# EAGLE schematic Main (EAGLE 7.7.0)
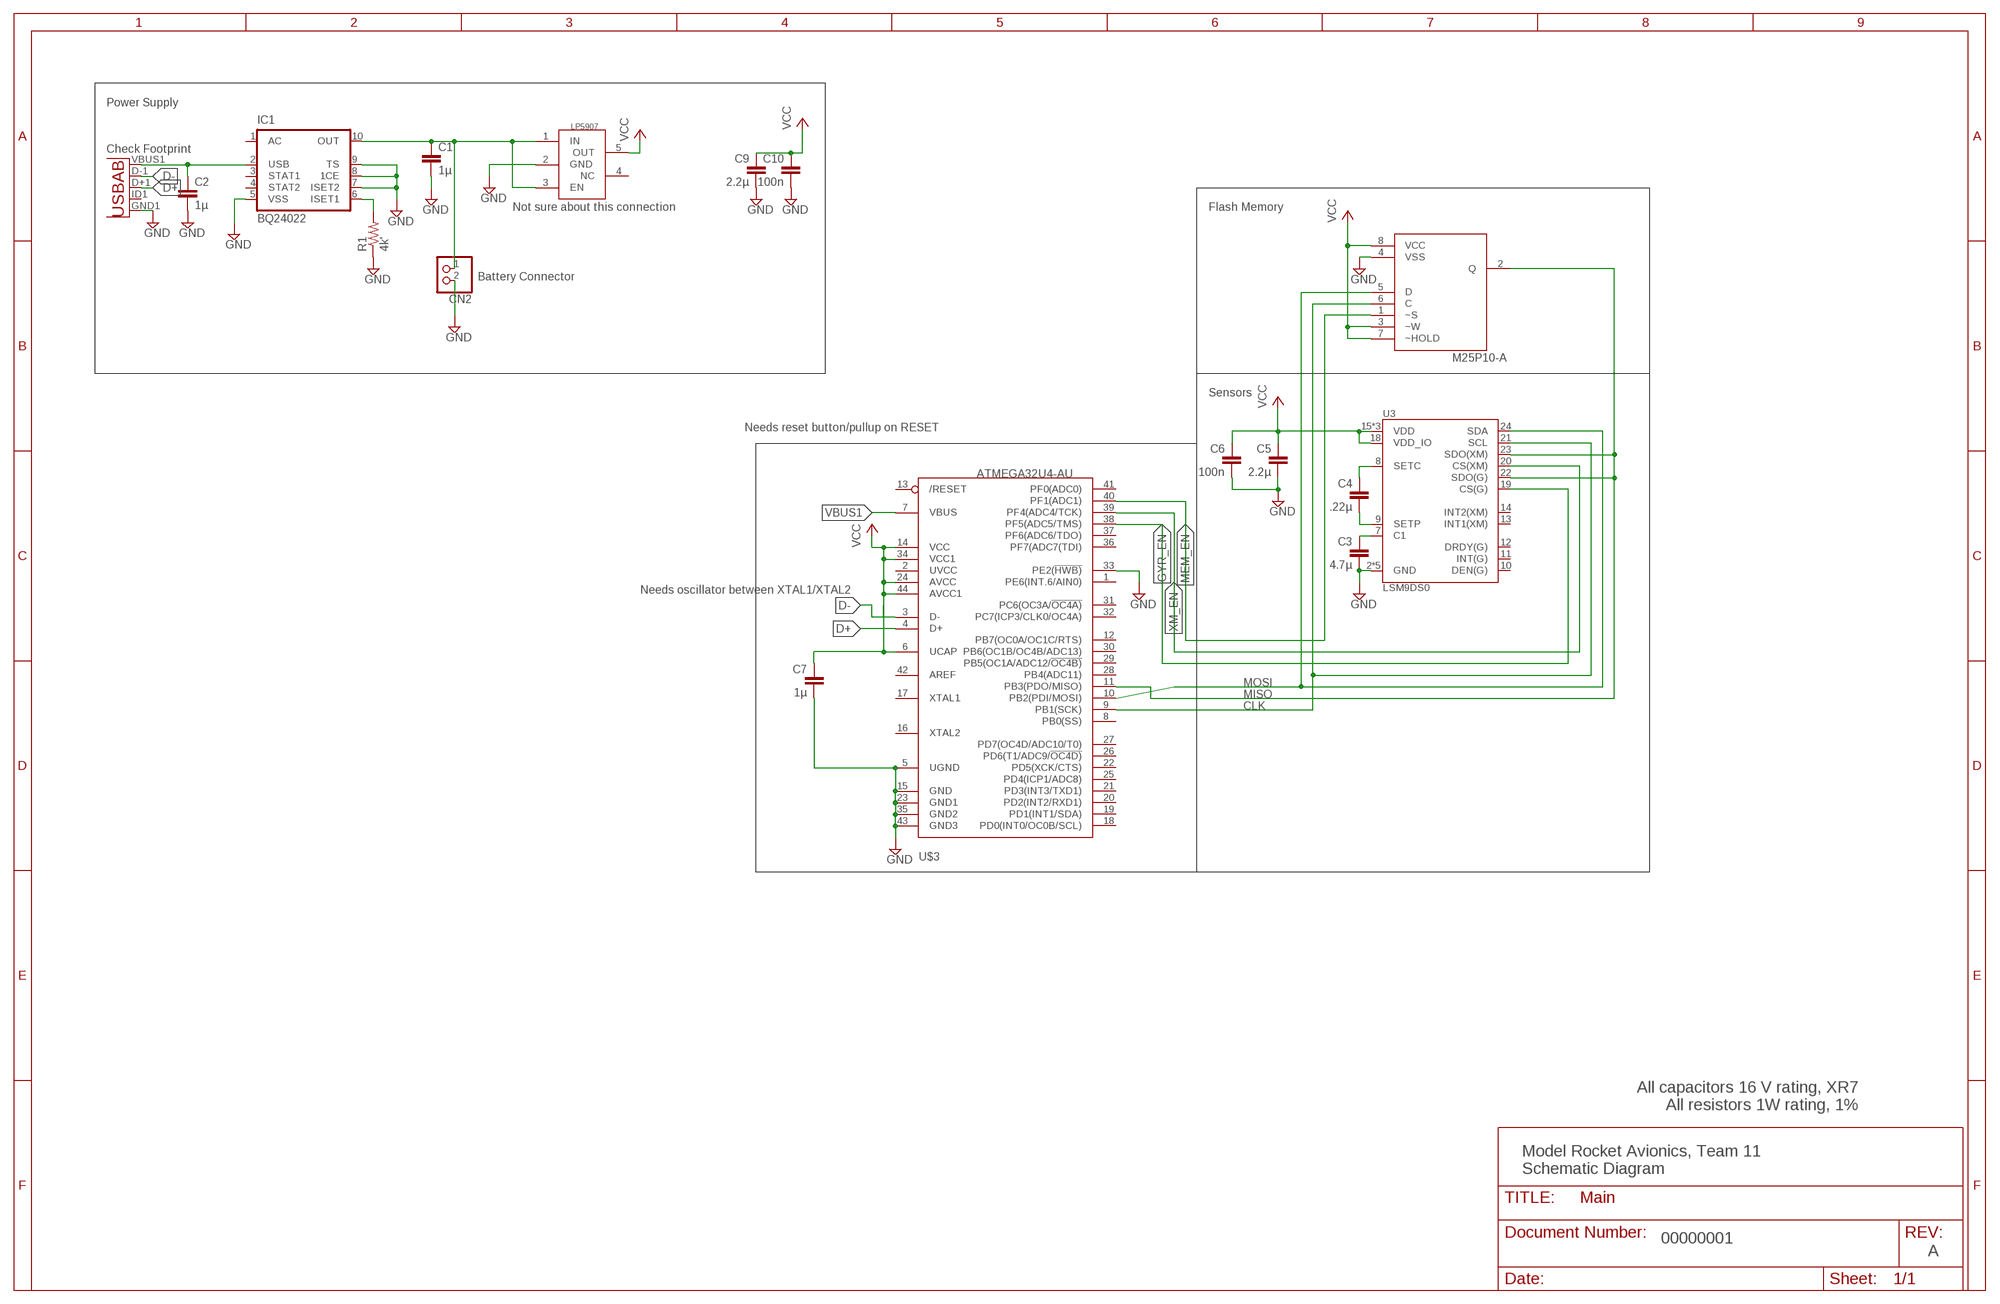
[diagram p0: schematic, sheet 1]

## Parts
C1  1µ  C-EU050-025X075  [C050-025X075]
C2  1µ  C-EU050-025X075  [C050-025X075]
C3  4.7µ  C-EUC0805  [C0805]
C4  .22µ  C-EUC0805  [C0805]
C5  2.2µ  C-EUC0805  [C0805]
C6  100n  C-EUC0805  [C0805]
C7  1µ  C-EUC0805  [C0805]
C9  2.2µ  C-EUC0805  [C0805]
C10  100n  C-EUC0805  [C0805]
CN2  JST_2PIN-SMT-RA  [JST-PH-2-SMT-RA]
IC1  BQ24022  [DRC-S-PVSON-N10]
R1  4k'  R-US_0309/12  [0309/12]
U1  USB_In  USB""  [USB-MICRO-SMD]
U3  LSM9DS0  [LGA-24]
U$1  M25P10-AVMN6TP_TR  [SOIC127P600X175-8N]
U$2  LP5907  [SOT23-5L]
U$3  ATMEGA32U4-AU  [TQFP44]

## Nets
CLK: U3.21(SCL) U$1.6(C) U$3.9(PB1(SCK))
D+: U1.D+1(D+) U$3.4(D+)
D-: U1.D-1(D-) U$3.3(D-)
GND: C1.2 C2.2 C3.1 C5.2 C6.2 C7.2 C9.2 C10.2 CN2.2 IC1.5(VSS) IC1.7(ISET2) IC1.8(1CE) IC1.9(TS) R1.1 U1.GND1(GND) U3.2(GND) U3.3(GND) U3.4(GND) U3.5(GND) U3.6(GND) U$1.4(VSS) U$2.2(GND) U$3.5(UGND) U$3.15(GND) U$3.23(GND1) U$3.33(PE2(!HWB)) U$3.35(GND2) U$3.43(GND3)
GYR_EN: U3.19(CS(G)) U$3.38(PF5(ADC5/TMS))
MEM_EN: U$1.1(~S) U$3.40(PF1(ADC1))
MISO: U3.22(SDO(G)) U3.23(SDO(XM)) U$1.2(Q) U$3.11(PB3(PDO/MISO))
MOSI: U3.24(SDA) U$1.5(D) U$3.10(PB2(PDI/MOSI))
N$1: C2.1 IC1.2(USB) U1.VBUS1(VBUS)
N$4: IC1.6(ISET1) R1.2
N$9: C3.2 U3.7(C1)
N$10: C4.2 U3.8(SETC)
N$11: C4.1 U3.9(SETP)
N$17: C1.1 CN2.1 IC1.10(OUT) U$2.1(IN) U$2.3(EN)
VBUS1: U$3.7(VBUS)
VCC: C5.1 C6.1 C7.1 C9.1 C10.1 U3.15(VDD) U3.16(VDD) U3.17(VDD) U3.18(VDD_IO) U$1.3(~W) U$1.7(~HOLD) U$1.8(VCC) U$2.5(OUT) U$3.6(UCAP) U$3.14(VCC) U$3.24(AVCC) U$3.34(VCC1) U$3.44(AVCC1)
XM_EN: U3.20(CS(XM)) U$3.39(PF4(ADC4/TCK))
Unconnected: IC1.1(AC) IC1.3(STAT1) IC1.4(STAT2) IC1.TH U1.ID1(USBID) U3.10(DEN(G)) U3.11(INT(G)) U3.12(DRDY(G)) U3.13(INT1(XM)) U3.14(INT2(XM)) U$2.4(NC) U$3.1(PE6(INT.6/AIN0)) U$3.2(UVCC) U$3.8(PB0(SS)) U$3.12(PB7(OC0A/OC1C/RTS)) U$3.13(/RESET) U$3.16(XTAL2) U$3.17(XTAL1) U$3.18(PD0(INT0/OC0B/SCL)) U$3.19(PD1(INT1/SDA)) U$3.20(PD2(INT2/RXD1)) U$3.21(PD3(INT3/TXD1)) U$3.22(PD5(XCK/CTS)) U$3.25(PD4(ICP1/ADC8)) U$3.26(PD6(T1/ADC9/!OC4D)) U$3.27(PD7(OC4D/ADC10/T0)) U$3.28(PB4(ADC11)) U$3.29(PB5(OC1A/ADC12/!OC4B)) U$3.30(PB6(OC1B/OC4B/ADC13)) U$3.31(PC6(OC3A/!OC4A)) U$3.32(PC7(ICP3/CLK0/OC4A)) U$3.36(PF7(ADC7(TDI)) U$3.37(PF6(ADC6/TDO)) U$3.41(PF0(ADC0)) U$3.42(AREF)

## Notes on the sheet
- Power Supply
- Check Footprint
- Not sure about this connection | Flash Memory
- Battery Connector
- Sensors
- Needs reset button/pullup on RESET
- Needs oscillator between XTAL1/XTAL2
- All capacitors 16 V rating, XR7
  All resistors 1W rating, 1%
- Model Rocket Avionics, Team 11
  Schematic Diagram
- 00000001
- A

## Library data of the parts
C1-C7 C9 C10 = rcl:C-EU: CAPACITOR, European symbol
CN2 = adafruit:JST_2PIN: JST 2-Pin Connectors of various flavors SMT-RA (S2B-PH-SM4) 4UConnector #17311 SMT (B2B-PH-SM4) THM-RA (S2B-PH) THM (B2B-PH)
IC1 = texas:BQ24022: SINGLE-CHIP, LI-ION AND LI-POL CHARGER IC WITH AUTONOMOUS USB-PORT AND AC-ADAPTER SUPPLY MANAGEMENT (bqTINY™-II) Source: bq24022.pdf (www.ti.com)
R1 = rcl:R-US_: RESISTOR, American symbol
U1 = MicroUSB:USB: This is a USB AB connector that is compatible with USB OTG. i.e. this connector can serve as a host or device
U3 = LSM9DS0:LSM9DS0; AVAILABILITY: Warning; DESCRIPTION: iNEMO inertial module: 3D accelerometer, 3D gyroscope, 3D magnetometer; MF: STMicroelectronics; MP: LSM9DS0; PACKAGE: LGA-24 STMicroelectronics; PRICE: 4.67 USD
U$1 = SOIC127P600X175-8N:M25P10-AVMN6TP_TR
U$2 = adafruit:LP5907
U$3 = adafruit:ATMEGA32U4: http://www.ladyada.net/library/eagle